# Altium schematic sheet AFE.SchDoc: =Project
size 420 x 297 mm; Author: G.Kasprowicz; CompanyName: WUT ISE; DrawnBy: G.Kasprowicz; Organization: WUT ISE; Address1: PW ISE; Address2: Nowowiejska 15/19 00-665 Warsaw; Address3: gkasprow@gmail.com; SheetNumber: -; SheetTotal: -; ModifiedBy: -; CheckedDate: -; Title2: AFE; DivGrp: WUT ISE; Designer: G.Kasprowicz; SPICEModelCacheRYPVXPCY: <root> / <DocumentId>RYPVXPCY</DocumentId> / </root>; ModifiedDate: -; ProjectName: Sensor Box
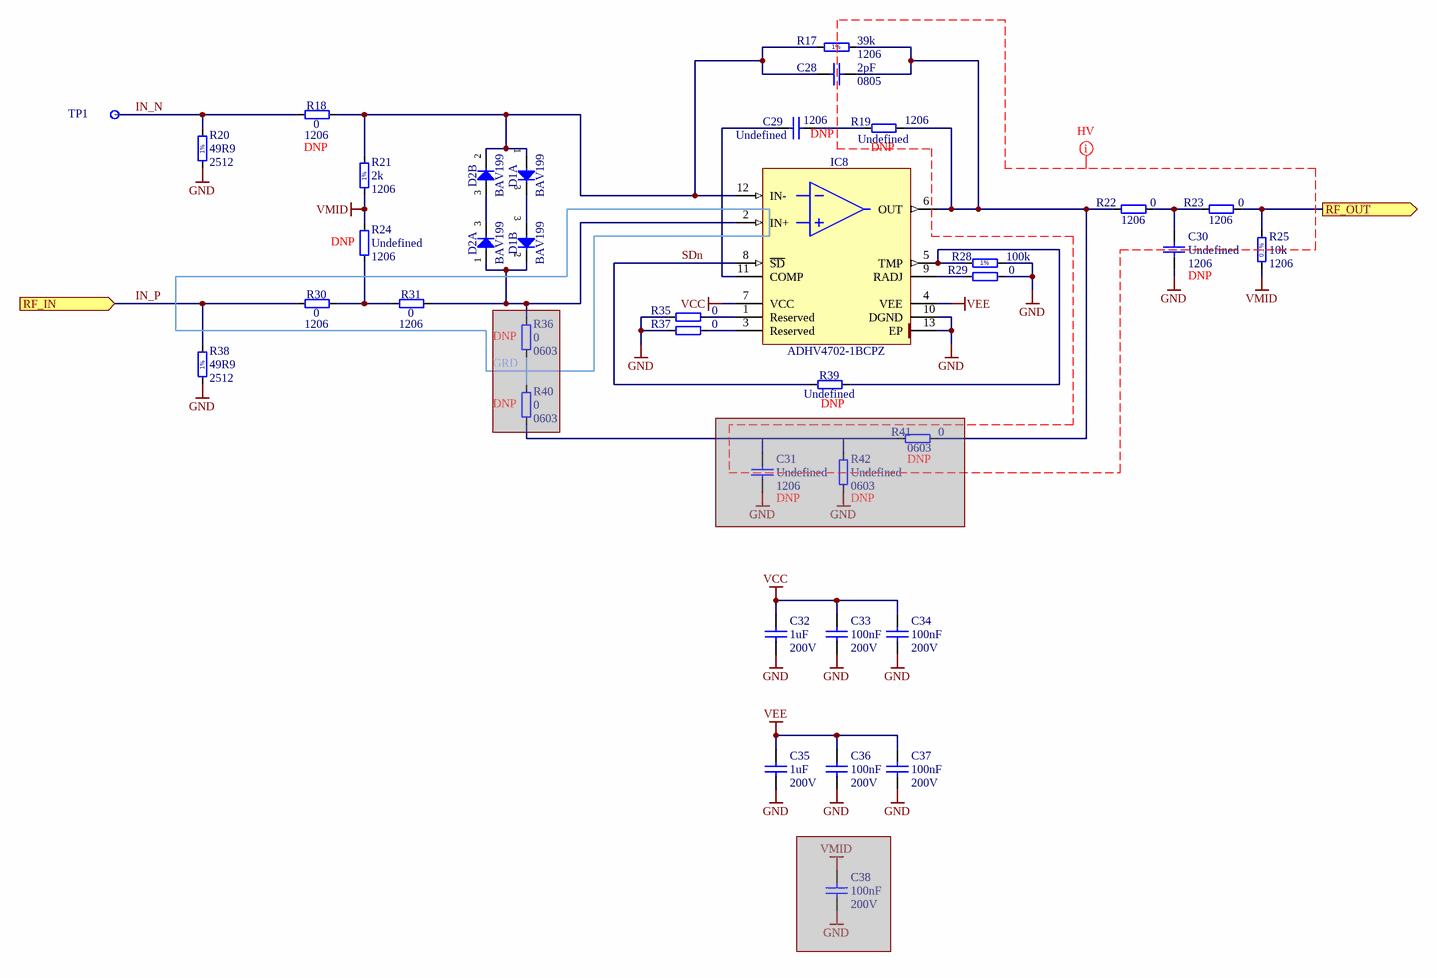
[diagram p0: AFE.SchDoc]

## Parts
C28  2pF  Case: 0805  [CAPC2012X135N]
C29  Undefined  Case: 1206  [CAPC3216X140N]
C30  Undefined  Case: 1206  [CAPC3216X140N]
C31  Undefined  Case: 1206  [CAPC3216X140N]  (masked out: inside a compile mask, not in the netlist)
C32  1uF  Voltage: 200V  [CAPC5664X218N]
C33  100nF  Voltage: 200V  [CAPC3216X140N]
C34  100nF  Voltage: 200V  [CAPC3216X140N]
C35  1uF  Voltage: 200V  [CAPC5664X218N]
C36  100nF  Voltage: 200V  [CAPC3216X140N]
C37  100nF  Voltage: 200V  [CAPC3216X140N]
C38  100nF  Voltage: 200V  [CAPC3216X140N]  (masked out: inside a compile mask, not in the netlist)
D1  BAV199  [SOT95P240X110-3N]  (parts A,B of 2)
D2  BAV199  [SOT95P240X110-3N]  (parts A,B of 2)
IC8  ADHV4702-1BCPZ  [QFN170P700X700X80-13N-S290]
R17  39k  Case: 1206  [RESC3216X65N]
R18  0  Case: 1206  [RESC3216X65N]
R19  Undefined  Case: 1206  [RESC3216X65N]
R20  49R9  Case: 2512  [RESC6331X70N]
R21  2k  Case: 1206  [RESC3216X65N]
R22  0  Case: 1206  [RESC3216X65N]
R23  0  Case: 1206  [RESC3216X65N]
R24  Undefined  Case: 1206  [RESC3216X65N]
R25  10k  Case: 1206  [RESC3216X65N]
R28  100k  [RESC1005X40N]
R29  0  [RESC1608X55N]
R30  0  Case: 1206  [RESC3216X65N]
R31  0  Case: 1206  [RESC3216X65N]
R35  0  [RESC1608X55N]
R36  0  Case: 0603  [RESC1608X55N]  (masked out: inside a compile mask, not in the netlist)
R37  0  [RESC1608X55N]
R38  49R9  Case: 2512  [RESC6331X70N]
R39  Undefined  [RESC1608X55N]
R40  0  Case: 0603  [RESC1608X55N]  (masked out: inside a compile mask, not in the netlist)
R41  0  Case: 0603  [RESC1608X55N]  (masked out: inside a compile mask, not in the netlist)
R42  Undefined  Case: 0603  [RESC1608X55N]  (masked out: inside a compile mask, not in the netlist)
TP1  Test Point  [TPS127]  (value not drawn)

## Ports
RF_IN (in), RF_OUT (out)

## Nets
GND: C30.1 C32.1 C33.1 C34.1 C35.1 C36.1 C37.1 IC8.10(DGND) IC8.13(EP) R20.1 R28.1 R29.2 R35.1 R37.1 R38.1
VCC: C32.2 C33.2 C34.2 IC8.7(VCC)
VEE: C35.2 C36.2 C37.2 IC8.4(VEE)
VMID: R21.1 R24.2 R25.1
IN_N: R18.1 R20.2 TP1.1
IN_P: R30.1 R38.2 ; port RF_IN
RF_OUT: R23.2 R25.2 ; port RF_OUT
SDn: IC8.8(~{SD}) R39.1
NetC28_1: C28.1 D1.1(A) D2.2(C) IC8.12(IN-) R17.1 R18.2 R21.2
NetC28_2: C28.2 IC8.6(OUT) R17.2 R19.1 R22.1
NetC29_1: C29.1 R19.2
NetC29_2: C29.2 IC8.11(COMP)
NetC30_2: C30.2 R22.2 R23.1
NetD1_2: D1.2(C) D2.1(A) IC8.2(IN+) R31.2
NetIC8_1: IC8.1(Reserved) R35.2
NetIC8_3: IC8.3(Reserved) R37.2
NetIC8_5: IC8.5(TMP) R28.2 R39.2
NetIC8_9: IC8.9(RADJ) R29.1
NetR24_1: R24.1 R30.2 R31.1

Not connected (* = marked no-connect by the designer): D1 3(COMAC); D2 3(COMAC)

## Layout directives
net class HV: GND, VEE, VMID

## Notes on the sheet
- DNP
- (near C29) DNP
- (near R19) DNP
- (near R24) DNP
- (near C30) DNP
- (near R36) DNP
- (near R40) DNP
- (near R39) DNP
- (near C31) DNP
- (near R42) DNP
- (near R41) DNP
- Project/Equipment
- Document
- Designer
- Drawn by
- Check.by
- Copyright WUT ISE 2018.
  This documentation describes Open Hardware and is licensed under the CERN OHL v.1.1. You may redistribute and modify this documentation under the terms of the CERN OHL v.1.1. (http://ohwr.org/CERNOHL). This documentation is distributed WITHOUT ANY EXPRESS OR IMPLIED WARRANTY, INCLUDING OF MERCHANTABILITY, SATISFACTORY QUALITY AND FITNESS FOR A PARTICULAR PURPOSE. Please see the CERN OHL v.1.1 for applicable conditions.
- Contact
- File
- Last Mod.
- Print Date
- Sheet
- Size
- A3
- of
- Rev
- (in symbol R0402_100K_1%_0.0625W_100PPM) 1%
- (in symbol R1206_2K_1%_0.25W_100PPM) 1%
- (in symbol R1206_10K_0.1%_0.3W_0.2PPM_VISHAY_Y402310K0000T9R) 0.1%
- (in symbol R1206_39K_1%_0.25W_100PPM) 1%
- (in symbol R2512_49R9_1%_1W_100PPM_VISHAY_CRCW) 1%

## Library data of the parts
C28 = CC0805_2PF_250V_0.25PF_C0G_MURATA: Non-polarised capacitor; Part Description: Multilayer Ceramic Capacitors MLCC - SMD/SMT 2 pF 250 VDC 0.25 pF 0805 C0G (NP0); Manufacturer: MURATA; Manufacturer Part Number: GQM2195C2E2R0CB12D; Voltage: 250V; TC: C0G/NP0; Tolerance: ±0.25pF; Part Number: CC0805_2PF_250V_0.25PF_C0G; Component Kind: Standard; Component Type: Standard; Footprint: CAPC2013X115N; Pin Count: 2; Value: 2pF; Status: None; Mounted: Yes; Socket: No; SMD: Yes; Sense: No; ComponentHeight: 1.14mm; HelpURL: \\cern.ch\dfs\Applications\Altium\Datasheets\CC0805_C0G_AVX_U.pdf; Author: CERN DEM JLC; CreateDate: 27/01/2015; LatestRevisionDate: 13/03/2018
C29-C31 = CC1206_NO-VALUE: Non-polarised capacitor; Part Description: Reserved Footprint For a 1206 (3216) Chip Ceramic Capacitor; Mounted: No; Part Number: CC1206_NO-VALUE; Component Kind: Standard; Component Type: Standard; Pin Count: 2; Value: Undefined; Status: None; Manufacturer: Undefined; Manufacturer Part Number: CC1206_NO-VALUE; Socket: No; SMD: Yes; Sense: No; Manufacturer1 ComponentHeight: 1.4mm; HelpURL: Undefined; Author: CERN DEM JLC; CreateDate: 05/05/2008; LatestRevisionDate: 16/11/2009
C32 C35 = CC2225_1UF_200V_10%_X7R: Non-polarised capacitor; Part Description: Multilayer Ceramic Chip Capacitor; Manufacturer: GENERIC; Manufacturer1 Part Number: VJ2225Y105KXCAT; TC: X7R; Tolerance: ±10%; Part Number: CC2225_1UF_200V_10%_X7R; Component Kind: Standard; Component Type: Standard; Pin Count: 2; Value: 1uF; Status: None; Manufacturer Part Number: CC2225_1UF_200V_10%_X7R; Case: 2225; Mounted: Yes; Socket: No; SMD: Yes; Sense: No; Manufacturer1 Example: VISHAY VITRAMON; Manufacturer1 ComponentHeight: 2.18mm; HelpURL: \\cern.ch\dfs\Applications\Altium\Datasheets\CC2225_X7R_VISHAY_VJ.pdf; Author: CERN DEM BC; CreateDate: 25/09/2019; LatestRevisionDate: 25/09/2019
C33 C34 C36-C38 = CC1206_100NF_200V_10%_X7R: Non-polarised capacitor; Part Description: SMD Ceramic Chip Capacitor; Manufacturer: GENERIC; Manufacturer1 Part Number: C1206C104K2RAC; TC: X7R; Tolerance: ±10%; Part Number: CC1206_100NF_200V_10%_X7R; Component Kind: Standard; Component Type: Standard; Pin Count: 2; Value: 100nF; Status: None; Manufacturer Part Number: CC1206_100NF_200V_10%_X7R; Case: 1206; Mounted: Yes; Socket: No; SMD: Yes; Sense: No; Manufacturer1 Example: KEMET; Manufacturer1 ComponentHeight: 1.4mm; HelpURL: \\cern.ch\dfs\Applications\Altium\Datasheets\CC1206_X7R_KEMET.pdf; Author: CERN DEM JLC; CreateDate: 16/09/2009; LatestRevisionDate: 16/09/2009
D1 D2 = BAV199: Serial Diode; Part Description: Low-Leakage Double Diode; Manufacturer: NXP SEMICONDUCTORS; Voltage: 75V; Power: 250mW; PressFit: No; Bonding: No; Part Number: BAV199; Component Kind: Standard; Component Type: Standard; Device: BAV199; PackageDescription: SOT, 0.95mm Pitch; 3 Pin, 1.40mm W X 3.00mm L X 1.10mm H, IPC Medium Density; Manufacturer Part Number: BAV199; Pin Count: 3; Case: SOT23-3; Mounted: Yes; Socket: No; SMD: Yes; Sense: No; ComponentHeight: 1.1mm; HelpURL: \\cern.ch\dfs\Applications\Altium\Datasheets\BAV199.pdf; Author: CERN DEM JMW; CreateDate: 21/11/2008; LatestRevisionDate: 21/11/2008
IC8 = ADHV4702-1BCPZ: 24V to 220V Precision Operational Amplifier; Manufacturer: ANALOG DEVICES; PressFit: No; Bonding: No; Part Number: ADHV4702-1BCPZ; Component Kind: Standard; Component Type: Standard; Device: ADHV4702-1BCPZ; PackageDescription: QFN, 1.70mm Pitch, Square; 12 pin, 7.00mm L X 7.00mm W X 0.80mm H body (w/Thermal Tab 2.9 X 2.9mm), IPC Medium Density; Part Description: 24V to 220V Precision Operational Amplifier; Manufacturer Part Number: ADHV4702-1BCPZ; Pin Count: 13; Case: QFN12; Mounted: Yes; Socket: No; SMD: Yes; Sense: No; ComponentHeight: 0.8mm; Author: CERN DEM BC; HelpURL: \\cern.ch\dfs\Applications\Altium\Datasheets\ADHV4702-1BCPZ.pdf; CreateDate: 29/08/2019; LatestRevisionDate: 29/08/2019
R17 = R1206_39K_1%_0.25W_100PPM: Resistor - 1%; Part Description: General Purpose Thick Film Chip Resistor; Manufacturer: GENERIC; Manufacturer1 Part Number: NRC12F3902TRF; Power: 0.25W; TC: ±100ppm/°C; PressFit: No; Part Number: R1206_39K_1%_0.25W_100PPM; Component Kind: Standard; Component Type: Standard; Pin Count: 2; Value: 39k; Status: Preferred; Tolerance: ±1%; Manufacturer Part Number: R1206_39K_1%_0.25W_100PPM; Mounted: Yes; Sense: No; Socket: No; SMD: Yes; Manufacturer1 Example: NIC COMPONENT; Manufacturer1 ComponentHeight: 0.65mm; HelpURL: \\cern.ch\dfs\Applications\Altium\Datasheets\R1206_NIC_NRC.pdf; Author: CERN DEM JLC; CreateDate: 03/12/2007; LatestRevisionDate: 13/03/2008
R18 R22 R23 R30 R31 = R1206_0R_JUMPER: Resistor; Part Description: 2A (0.05R Max DC Resistance) Zero Ohm Jumper; Manufacturer: GENERIC; Manufacturer1 Part Number: NRC12Z0; PressFit: No; Part Number: R1206_0R_JUMPER; Component Kind: Standard; Component Type: Standard; Pin Count: 2; Value: 0; Status: Preferred; Manufacturer Part Number: R1206_0R_JUMPER; Mounted: Yes; Sense: No; Socket: No; SMD: Yes; Manufacturer1 Example: NIC COMPONENT; Manufacturer1 ComponentHeight: 0.65mm; HelpURL: \\cern.ch\dfs\Applications\Altium\Datasheets\R1206_NIC_NRC.pdf; Author: CERN DEM JLC; CreateDate: 03/12/2007; LatestRevisionDate: 13/03/2008
R19 R24 = R1206_NO-VALUE: Resistor; Part Description: Reserved Footprint For a 1206 (3216) Chip Resistor; PressFit: No; Mounted: No; Part Number: R1206_NO-VALUE; Component Kind: Standard; Component Type: Standard; Pin Count: 2; Value: Undefined; Status: None; Manufacturer: Undefined; Manufacturer Part Number: R1206_NO-VALUE; Sense: No; Socket: No; SMD: Yes; Manufacturer1 Example: Undefined; Manufacturer1 Part Number: Undefined; Manufacturer1 ComponentHeight: Undefined; HelpURL: Undefined; Author: CERN DEM JLC; CreateDate: 03/12/2007; LatestRevisionDate: 13/03/2008
R20 R38 = R2512_49R9_1%_1W_100PPM_VISHAY_CRCW: Resistor - 1%; Part Description: Thick Film Chip Resistor; Manufacturer: VISHAY DRALORIC; Manufacturer Part Number: CRCW251249R9FKEG; Power: 1W; TC: ±100ppm/°C; PressFit: No; Part Number: R2512_49R9_1%_1W_100PPM_VISHAY_CRCW; Component Kind: Standard; Component Type: Standard; Pin Count: 2; Value: 49R9; Status: None; Tolerance: ±1%; Mounted: Yes; Sense: No; Socket: No; SMD: Yes; ComponentHeight: 0.7mm; HelpURL: \\cern.ch\dfs\Applications\Altium\Datasheets\R2512_VISHAY_CRCW2512.pdf; Author: CERN DEM JLC; CreateDate: 22/05/2012; LatestRevisionDate: 22/05/2012
R21 = R1206_2K_1%_0.25W_100PPM: Resistor - 1%; Part Description: General Purpose Thick Film Chip Resistor; Manufacturer: GENERIC; Manufacturer1 Part Number: NRC12F2001TRF; Power: 0.25W; TC: ±100ppm/°C; PressFit: No; Part Number: R1206_2K_1%_0.25W_100PPM; Component Kind: Standard; Component Type: Standard; Pin Count: 2; Value: 2k; Status: Preferred; Tolerance: ±1%; Manufacturer Part Number: R1206_2K_1%_0.25W_100PPM; Mounted: Yes; Sense: No; Socket: No; SMD: Yes; Manufacturer1 Example: NIC COMPONENT; Manufacturer1 ComponentHeight: 0.65mm; HelpURL: \\cern.ch\dfs\Applications\Altium\Datasheets\R1206_NIC_NRC.pdf; Author: CERN DEM JLC; CreateDate: 03/12/2007; LatestRevisionDate: 13/03/2008
R25 = R1206_10K_0.1%_0.3W_0.2PPM_VISHAY_Y402310K0000T9R: Resistor - 0.1%; Part Description: Z-1 Foil Ultra High Precision Wrap-around Chip Resistor (FRSM Series); Manufacturer: VISHAY PRECISION; Power: 0.3W; TC: ±0.2ppm/°C; PressFit: No; Part Number: R1206_10K_0.1%_0.3W_0.2PPM_VISHAY_Y402310K0000T9R; Component Kind: Standard; Component Type: Standard; Footprint: RESC3216X64N; Pin Count: 2; Value: 10k; Status: Not Recommended; Tolerance: ±0.1%; Manufacturer Part Number: Y402310K0000T9R; Mounted: Yes; Sense: No; Socket: No; SMD: Yes; ComponentHeight: 0.64mm; HelpURL: \\cern.ch\dfs\Applications\Altium\Datasheets\R1206_VISHAY_FRSM.pdf; Author: CERN DEM JLC; CreateDate: 14/07/2011; LatestRevisionDate: 14/07/2011
R28 = R0402_100K_1%_0.0625W_100PPM: Resistor - 1%; Part Description: General Purpose Thick Film Chip Resistor; Manufacturer: GENERIC; Manufacturer1 Part Number: 232270671004L; PressFit: No; TC: ±100ppm/°C; Part Number: R0402_100K_1%_0.0625W_100PPM; Component Kind: Standard; Component Type: Standard; Pin Count: 2; Value: 100k; Status: Not Recommended; Manufacturer Part Number: R0402_100K_1%_0.0625W_100PPM; Case: 0402; Mounted: Yes; Sense: No; Socket: No; SMD: Yes; Manufacturer1 Example: YAGEO PHYCOMP; Manufacturer1 ComponentHeight: 0.4mm; HelpURL: \\cern.ch\dfs\Applications\Altium\Datasheets\R0402_Phycomp_RC0402.pdf; Author: CERN DEM JLC; CreateDate: 03.12.2007; LatestRevisionDate: 17.10.2012; Power: 0.0625W; Tolerance: ±1%
R29 R35-R37 R40 R41 = R0603_0R_JUMPER: Resistor; Part Description: 1A (0.05R Max DC Resistance) Zero Ohm Jumper; Manufacturer: GENERIC; Manufacturer1 Part Number: NRC06Z0; PressFit: No; Part Number: R0603_0R_JUMPER; Component Kind: Standard; Component Type: Standard; Pin Count: 2; Value: 0; Status: Preferred; Manufacturer Part Number: R0603_0R_JUMPER; Mounted: Yes; Sense: No; Socket: No; SMD: Yes; Manufacturer1 Example: NIC COMPONENT; Manufacturer1 ComponentHeight: 0.55mm; HelpURL: \\cern.ch\dfs\Applications\Altium\Datasheets\R0603_NIC_NRC.pdf; Author: CERN DEM JLC; CreateDate: 03/12/2007; LatestRevisionDate: 13/03/2008
  R29 R35 R37: Case: 0603
R39 R42 = R0603_NO-VALUE: Resistor; Part Description: Reserved Footprint For a 0603 (1608) Chip Resistor; PressFit: No; Mounted: No; Part Number: R0603_NO-VALUE; Component Kind: Standard; Component Type: Standard; Pin Count: 2; Value: Undefined; Status: None; Manufacturer: Undefined; Manufacturer Part Number: R0603_NO-VALUE; Sense: No; Socket: No; SMD: Yes; Manufacturer1 Example: Undefined; Manufacturer1 Part Number: Undefined; Manufacturer1 ComponentHeight: Undefined; HelpURL: Undefined; Author: CERN DEM JLC; CreateDate: 03/12/2007; LatestRevisionDate: 13/03/2008
  R39: Case: 0603
TP1 = SMD_PAD_1.27X1.27MM: Part Description: 1.27mm x 1.27mm PCB Copper Area (SMD Test Point); Mounted: No; Part Number: SMD_PAD_1.27X1.27MM; Component Kind: Standard (No BOM); Component Type: Standard (No BOM); Pin Count: 1; Family: Test Point; Socket: No; SMD: Yes; Sense: No; Status: None; ComponentHeight: 0mm; HelpURL: Undefined; Author: CERN DEM JLC; CreateDate: 12.01.2008; LatestRevisionDate: 12.01.2008; PackageDescription: 1.27mm x 1.27mm PCB Copper Area (SMD Test Point)